# EAGLE design vga_wifi (EAGLE 7.3.0)
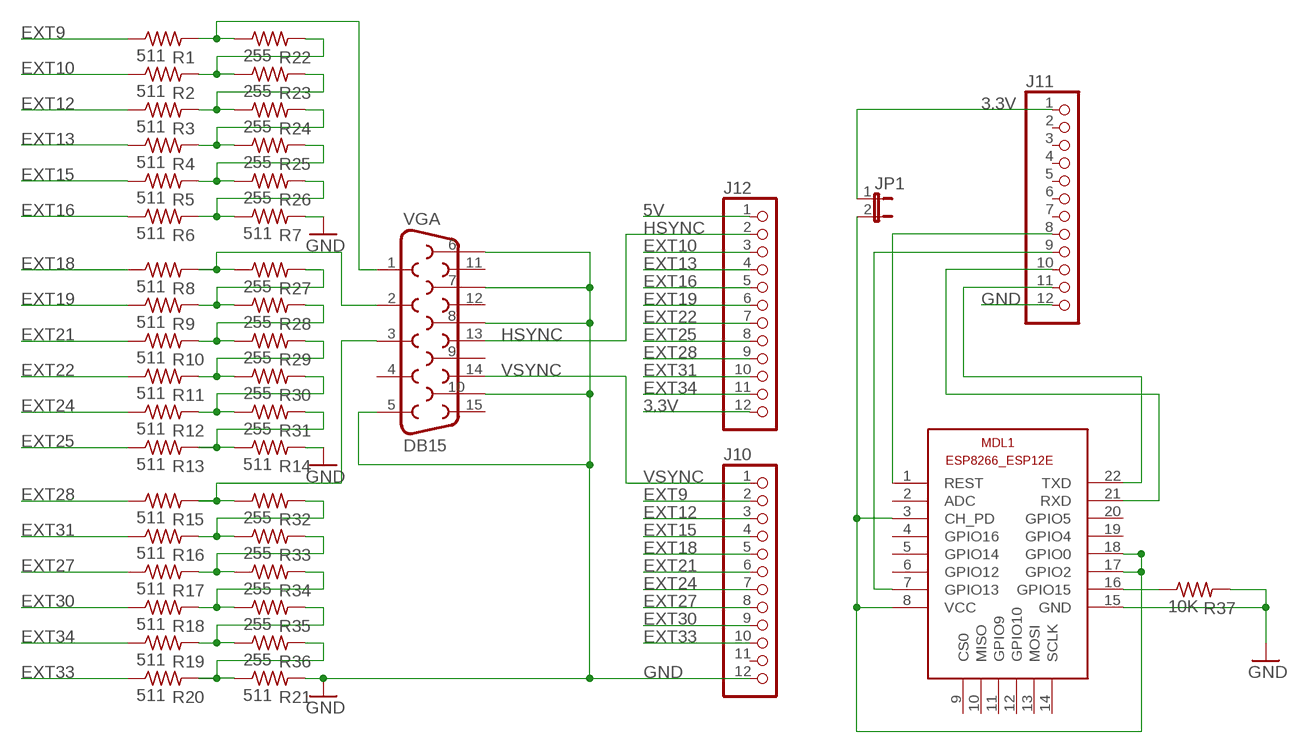
[diagram p0: schematic, sheet 1]

## Parts
J10  PINHD-1X12  [1X12]
J11  PINHD-1X12  [1X12]
J12  PINHD-1X12  [1X12]
JP1  JP1E  [JP1]
MDL1  ESP8266-12EESP8266-ESP12E  [ESP8266-ESP12E]
R1  511  R-US_R0805  [R0805]
R2  511  R-US_R0805  [R0805]
R3  511  R-US_R0805  [R0805]
R4  511  R-US_R0805  [R0805]
R5  511  R-US_R0805  [R0805]
R6  511  R-US_R0805  [R0805]
R7  511  R-US_R0805  [R0805]
R8  511  R-US_R0805  [R0805]
R9  511  R-US_R0805  [R0805]
R10  511  R-US_R0805  [R0805]
R11  511  R-US_R0805  [R0805]
R12  511  R-US_R0805  [R0805]
R13  511  R-US_R0805  [R0805]
R14  511  R-US_R0805  [R0805]
R15  511  R-US_R0805  [R0805]
R16  511  R-US_R0805  [R0805]
R17  511  R-US_R0805  [R0805]
R18  511  R-US_R0805  [R0805]
R19  511  R-US_R0805  [R0805]
R20  511  R-US_R0805  [R0805]
R21  511  R-US_R0805  [R0805]
R22  255  R-US_R0805  [R0805]
R23  255  R-US_R0805  [R0805]
R24  255  R-US_R0805  [R0805]
R25  255  R-US_R0805  [R0805]
R26  255  R-US_R0805  [R0805]
R27  255  R-US_R0805  [R0805]
R28  255  R-US_R0805  [R0805]
R29  255  R-US_R0805  [R0805]
R30  255  R-US_R0805  [R0805]
R31  255  R-US_R0805  [R0805]
R32  255  R-US_R0805  [R0805]
R33  255  R-US_R0805  [R0805]
R34  255  R-US_R0805  [R0805]
R35  255  R-US_R0805  [R0805]
R36  255  R-US_R0805  [R0805]
R37  10K  R-US_R0805  [R0805]
VGA  DB15  [DB15]

## Nets
3.3V: J11.1 J12.12 JP1.1
5V: J12.1
EXT9: J10.2 R1.1
EXT10: J12.3 R2.1
EXT12: J10.3 R3.1
EXT13: J12.4 R4.1
EXT15: J10.4 R5.1
EXT16: J12.5 R6.1
EXT18: J10.5 R8.1
EXT19: J12.6 R9.1
EXT21: J10.6 R10.1
EXT22: J12.7 R11.1
EXT24: J10.7 R12.1
EXT25: J12.8 R13.1
EXT27: J10.8 R17.1
EXT28: J12.9 R15.1
EXT30: J10.9 R18.1
EXT31: J12.10 R16.1
EXT33: J10.10 R20.1
EXT34: J12.11 R19.1
GND: J10.12 J11.12 MDL1.15(GND) R7.2 R14.2 R21.2 R37.2 VGA.5 VGA.6 VGA.7 VGA.8 VGA.10
GREEN: R8.2 R27.1 VGA.2
HSYNC: J12.2 VGA.13
N$1: MDL1.16(GPIO15) R37.1
N$2: J11.9 MDL1.7(GPIO13)
N$3: J11.10 MDL1.21(RXD)
N$4: J11.11 MDL1.22(TXD)
N$5: J11.8 MDL1.1(REST)
N$6: R20.2 R21.1 R36.2
N$8: R9.2 R27.2 R28.1
N$15: R2.2 R22.2 R23.1
N$16: R1.2 R22.1 VGA.1
N$17: R12.2 R30.2 R31.1
N$18: R6.2 R7.1 R26.2
N$19: R3.2 R23.2 R24.1
N$21: R4.2 R24.2 R25.1
N$23: R5.2 R25.2 R26.1
N$25: R11.2 R29.2 R30.1
N$26: R13.2 R14.1 R31.2
N$27: R10.2 R28.2 R29.1
N$41: R15.2 R32.1 VGA.3
N$42: R16.2 R32.2 R33.1
N$43: R17.2 R33.2 R34.1
N$44: R18.2 R34.2 R35.1
N$45: R19.2 R35.2 R36.1
VIN: JP1.2 MDL1.3(CH_PD) MDL1.8(VCC) MDL1.17(GPIO2) MDL1.18(GPIO0)
VSYNC: J10.1 VGA.14
Unconnected: J10.11 J11.2 J11.3 J11.4 J11.5 J11.6 J11.7 MDL1.2(ADC) MDL1.4(GPIO16) MDL1.5(GPIO14) MDL1.6(GPIO12) MDL1.9(CS0) MDL1.10(MISO) MDL1.11(GPIO9) MDL1.12(GPIO10) MDL1.13(MOSI) MDL1.14(SCLK) MDL1.19(GPIO4) MDL1.20(GPIO5) VGA.4 VGA.9 VGA.11 VGA.12 VGA.15

## Library data of the parts
J10-J12 = pinhead:PINHD-1X12: PIN HEADER
JP1 = jumper:JP1E: JUMPER
MDL1 = ESP8266-ESP12E:ESP8266-12E: ESP8266-12E with additional I/O and GPIO04/05 corrected The author cannot warrant that this library is free from error or will meet your specific requirements. Created by PuceBaboon.com. Komagane, Nagano, JAPAN
R1-R37 = rcl:R-US_: RESISTOR, American symbol
VGA = SparkFun-Connectors:DB15: DB15 / VGA right angle through-hole female connector.

## Board
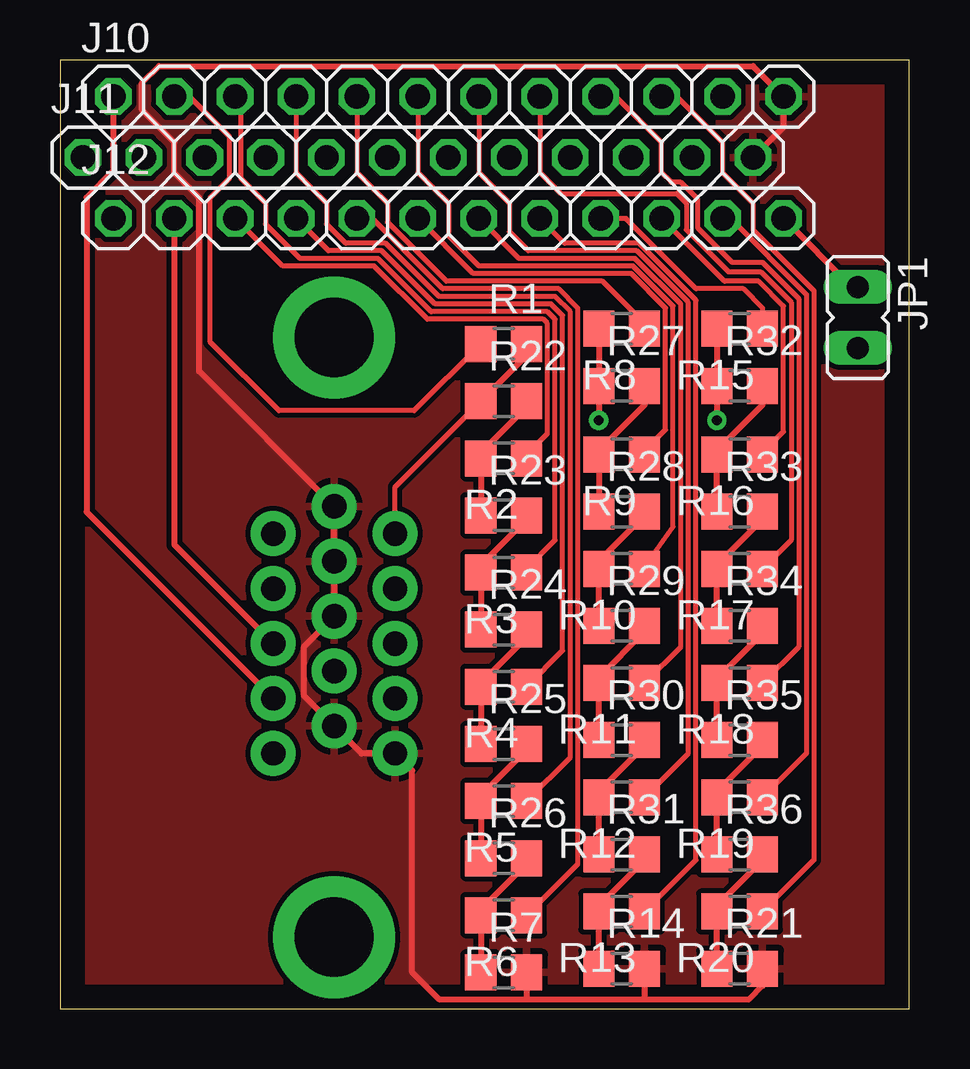
[diagram p1: board, top side]
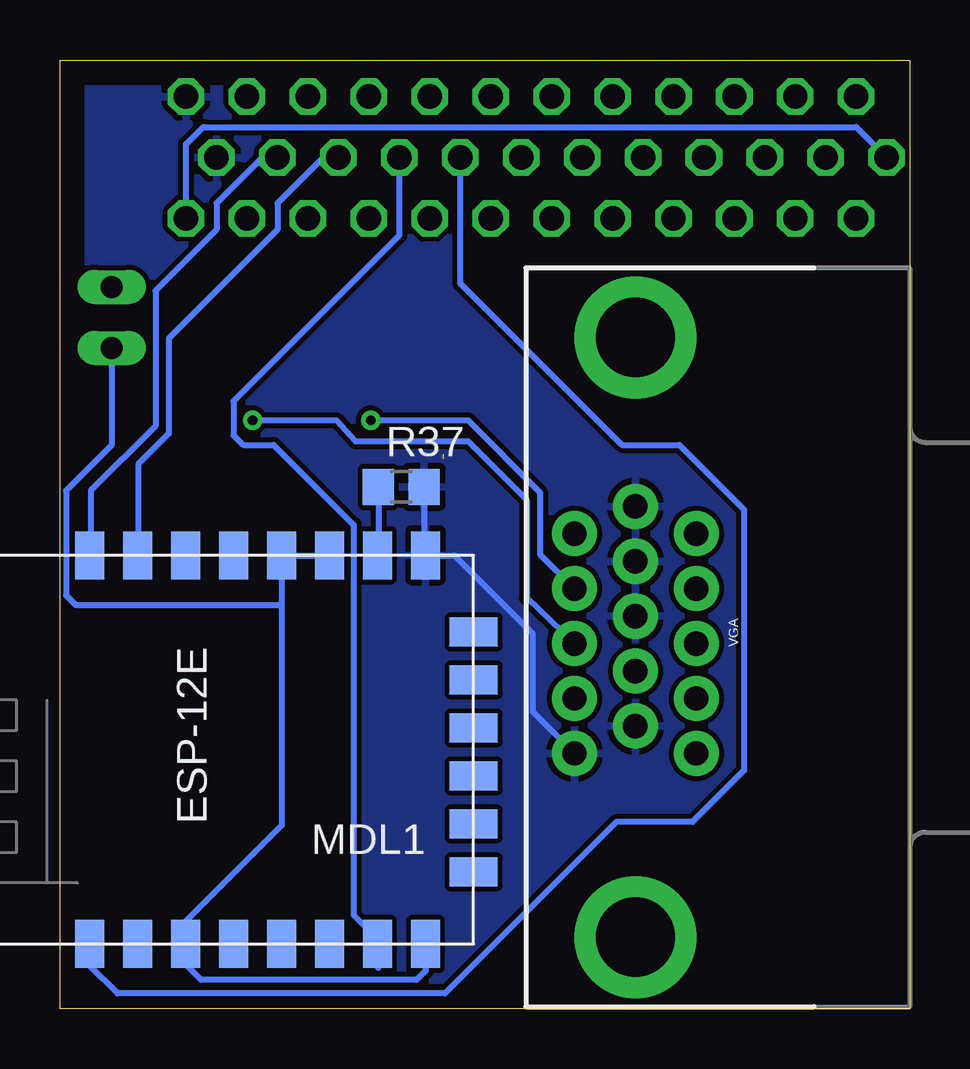
[diagram p2: board, bottom side, seen from below]

Size 35.4 x 39.53 mm. Coordinates in mm from the lower left corner, seen from the top.
Outline: 0,39.52 0,0 35.4,0 35.4,39.53 0,39.53
Copper layers (1*16): Top 0.035mm / dielectric 1.5mm / Bottom 0.035mm
Design rules "default": minimum track width 10mil, minimum drill 24mil, track to track 8mil, track to pad 8mil, pad to pad 8mil, via to via 8mil, smd to smd 8mil, copper to edge 40mil, drill to drill 8mil, minimum pad ring 10mil, minimum via ring 8mil, stop-mask expansion 4mil, vias tented up to drill 0mil, thermal gap 10mil

### Footprints (pad centres in the part's own frame; a part is rotated, then mirrored left to right if it is on the bottom)
1X12 = drill 1.016 octagon: 1 -13.97,0; 2 -11.43,0; 3 -8.89,0; 4 -6.35,0; 5 -3.81,0; 6 -1.27,0; 7 1.27,0; 8 3.81,0; 9 6.35,0; 10 8.89,0; 11 11.43,0; 12 13.97,0
JP1 = drill 0.914 long: 1 0,-1.27; 2 0,1.27
ESP8266-ESP12E = smd 2 x 1.2: 1 0,16; 2 0,14; 3 0,12; 4 0,10; 5 0,8; 6 0,6; 7 0,4; 8 0,2; 15 16.2,2; 16 16.2,4; 17 16.2,6; 18 16.2,8; 19 16.2,10; 20 16.2,12; 21 16.2,14; 22 16.2,16 | smd 1.2 x 2: 9 3,0; 10 5,0; 11 7,0; 12 9,0; 13 11,0; 14 13,0
R0805 = smd 1.3 x 1.5: 1 -0.95,0; 2 0.95,0
DB15 = drill 1.016 pad 1.88: 1 -4.32,-7.62; 2 -2.03,-7.62; 3 0.26,-7.62; 4 2.55,-7.62; 5 4.84,-7.62; 6 -5.46,-5.08; 7 -3.17,-5.08; 8 -0.88,-5.08; 9 1.41,-5.08; 10 3.7,-5.08; 11 -4.32,-2.54; 12 -2.03,-2.54; 13 0.26,-2.54; 14 2.55,-2.54; 15 4.84,-2.54 | drill 3.302 pad 5.08: G1 -12.5,-5.08; G2 12.5,-5.08

### Placement (x,y rotation side)
J10  16.19,38.02 0 top
J11  14.92,35.48 0 top
J12  16.19,32.94 0 top
JP1  33.26,28.81 180 top
MDL1  18.18,2.7 90 bottom
R1  18.49,27.7 0 top
R2  18.49,22.94 180 top
R3  18.49,18.18 180 top
R4  18.49,13.41 180 top
R5  18.49,8.65 180 top
R6  18.49,3.89 180 top
R7  18.49,1.51 0 top
R8  23.42,28.34 180 top
R9  23.42,23.1 180 top
R10  23.42,18.34 180 top
R11  23.42,13.57 180 top
R12  23.42,8.81 180 top
R13  23.42,4.05 180 top
R14  23.42,1.67 0 top
R15  28.34,28.34 180 top
R16  28.34,23.1 180 top
R17  28.34,18.34 180 top
R18  28.34,13.57 180 top
R19  28.34,8.81 180 top
R20  28.34,4.05 180 top
R21  28.34,1.67 0 top
R22  18.49,25.32 0 top
R23  18.49,20.56 0 top
R24  18.49,15.8 0 top
R25  18.49,11.03 0 top
R26  18.49,6.27 0 top
R27  23.42,25.96 0 top
R28  23.42,20.72 0 top
R29  23.42,15.95 0 top
R30  23.42,11.19 0 top
R31  23.42,6.43 0 top
R32  28.34,25.96 0 top
R33  28.34,20.72 0 top
R34  28.34,15.95 0 top
R35  28.34,11.19 0 top
R36  28.34,6.43 0 top
R37  21.19,21.75 0 bottom
VGA  6.35,15.48 270 bottom

### Tracks (layer width: path | path; a pad name or v marks a point on that pad's centre or on a via)
3.3V
  Top 0.254: JP1.1 33.02,30.08 J12.12
  Bottom 0.254: J12.12 30.16,36.04 29.45,36.75 2.22,36.75 J11.1
EXT9
  Top 0.203: R1.1 14.77,24.92 9.13,24.92 6.27,27.78 6.27,33.81 7.06,34.61 7.06,36.35 5.4,38.02 J10.2
EXT10  (1 unrouted)
  Top 0.203: 19.44,23.1 20.32,23.97 20.32,28.57 20.16,28.73 15.32,28.73 13.1,30.96 9.29,30.96 J12.3
EXT12
  Top 0.203: R3.1 19.44,18.33 20.64,19.53 20.64,28.73 20.32,29.05 15.48,29.05 13.26,31.27 10,31.27 8.57,32.7 8.57,33.58 7.54,34.61 7.54,37.78 J10.3
EXT13
  Top 0.203: 19.44,13.49 R4.1 20.95,14.93 20.95,28.89 20.48,29.37 15.64,29.37 13.41,31.59 11.19,31.59 J12.4
EXT15
  Top 0.203: 19.44,8.73 R5.1 21.27,10.48 21.27,29.05 20.64,29.69 15.8,29.69 13.57,31.91 11.91,31.91 11.11,32.7 11.11,33.58 9.84,34.85 J10.4
EXT16
  Top 0.203: 19.53,3.89 R6.1 21.59,6.04 21.59,29.21 20.8,30 15.95,30 13.02,32.94 J12.5
EXT18
  Top 0.203: R8.1 24.37,28.58 22.62,30.32 16.11,30.32 13.65,32.78 13.65,33.58 12.38,34.85 J10.5
EXT19
  Top 0.203: R9.1 24.37,23.25 25.24,24.13 25.24,29.21 23.81,30.64 17.22,30.64 J12.6
EXT21
  Top 0.203: R10.1 24.37,18.41 25.56,20.08 25.56,29.29 23.89,30.96 17.46,30.96 16.19,32.23 16.19,33.58 14.92,34.85 J10.6
EXT22
  Top 0.203: 24.37,13.65 R11.1 25.88,15.08 25.88,29.37 23.97,31.27 19.13,31.27 J12.7
EXT24
  Top 0.203: 24.37,9.05 R12.1 26.19,10.64 26.19,29.45 24.05,31.59 19.53,31.59 18.73,32.38 18.73,33.58 17.46,34.85 J10.7
EXT25
  Top 0.203: 24.37,4.2 R13.1 26.51,6.19 26.51,29.53 24.13,31.91 21.03,31.91 J12.8
EXT27
  Top 0.203: J10.8 20,34.85 20.88,33.97 25.72,33.97 26.11,33.58 26.11,32.46 27.86,30.72 29.21,30.72 30.48,29.45 30.48,19.53 R17.1
EXT28
  Top 0.203: J12.9 23.57,32.94 26.51,30 28.5,30 29.29,29.21 R15.1
EXT30
  Top 0.203: J10.9 23.18,38.02 25.08,36.12 25.08,34.85 25.48,34.45 25.88,34.45 26.59,33.73 26.59,32.54 28.02,31.11 29.29,31.11 30.8,29.61 30.8,15.08 R18.1
EXT31
  Top 0.203: R16.1 29.29,23.18 30.16,24.05 30.16,29.29 29.13,30.32 27.7,30.32 J12.10
EXT33
  Top 0.203: J10.10 25.72,38.02 27.62,36.12 27.62,34.85 28.89,33.58 28.89,32.46 31.43,29.92 31.43,6.19 R20.1
EXT34
  Top 0.203: J12.11 27.94,32.94 31.11,29.77 31.11,10.64 R19.1
GND
  Top 0.254: R7.2 19.45,0.4 | R21.2 29.29,0.95 28.73,0.4 24.45,0.4 | 19.45,0.4 15.8,0.4 14.68,1.51 14.68,9.92 VGA.5 12.57,10.64 VGA.10 10.16,13.05 10.16,15.08 11.36,16.28 VGA.8 VGA.7 VGA.6 5.79,26.57 5.79,33.81 4.76,34.85 4.76,36.12 3.41,37.47 3.41,38.58 4.13,39.29 28.89,39.29 J10.12 30.16,36.75 J11.12 | 19.45,0.4 24.45,0.4 | R14.2 24.37,0.48 24.45,0.4
  Bottom 0.254: VGA.5 15.72,12.38 15.72,15.64 18.98,18.9 MDL1.15 20.24,18.96 R37.2
  pour Bottom: 0.32,39.21 35.16,39.21 35.16,0.32 0.32,0.32
  pour Top: 0.32,39.21 35.16,39.21 35.16,0.32 0.32,0.32
GREEN  (via drill 0.4)
  Top 0.254: R8.2 R27.1 v22.47,24.53
  Bottom 0.254: v22.47,24.53 v22.46,24.53 18.41,24.53 15.4,21.51 15.4,18.94 VGA.2
HSYNC
  Top 0.254: J12.2 4.76,19.35 VGA.13
N$1
  Bottom 0.254: R37.1 22.14,18.93 MDL1.16
N$2
  Bottom 0.254: J11.9 21.27,32.23 28.18,25.32 28.18,23.89 27.78,23.5 26.51,23.5 23.18,20.16 23.18,3.89 22.15,2.86 22.15,1.7 MDL1.7
N$3
  Bottom 0.254: J11.10 24.45,35.48 26.35,33.58 26.35,32.46 30.88,27.94 30.88,23.97 32.15,22.7 32.15,18.93 MDL1.21
N$4
  Bottom 0.254: J11.11 26.99,35.48 28.89,33.58 28.89,32.46 31.43,29.92 31.43,24.29 34.13,21.59 34.13,18.94 MDL1.22
N$5
  Bottom 0.254: J11.8 18.73,30.24 11.99,23.5 9.6,23.5 6.91,20.8 6.91,9.92 9.05,7.78 12.22,7.78 19.37,0.64 33.02,0.64 34.21,1.83 34.21,2.67 MDL1.1
N$6
  Top 0.254: R36.2 29.29,6.19 27.39,4.29 R20.2 R21.1
N$8
  Top 0.254: 24.37,25.71 R27.2 24.37,25.16 22.47,23.26 R9.2 R28.1
N$15
  Top 0.254: R22.2 19.44,25.08 17.54,23.18 R2.2 R23.1
N$16
  Top 0.203: VGA.1 13.97,21.75 R22.1
  Top 0.254: R1.2 19.44,27.22 R22.1
N$17
  Top 0.254: R30.2 24.37,10.95 22.47,9.05 R12.2 R31.1
N$18
  Top 0.254: R26.2 19.44,6.03 17.54,4.13 R6.2 R7.1
N$19
  Top 0.254: R23.2 19.44,20.4 17.54,18.5 R3.2 R24.1
N$21
  Top 0.254: R24.2 19.44,15.48 17.54,13.58 R4.2 R25.1
N$23
  Top 0.254: R25.2 19.44,10.79 17.54,8.89 R5.2 R26.1
N$25
  Top 0.254: R29.2 24.37,15.71 22.47,13.81 R11.2 R30.1
N$26
  Top 0.254: R31.2 24.37,6.19 22.47,4.29 R13.2 R14.1
N$27
  Top 0.254: R28.2 24.37,20.56 22.47,18.66 R10.2 R29.1
N$41  (via drill 0.4)
  Top 0.254: R15.2 R32.1 v27.39,24.53
  Bottom 0.254: v27.39,24.53 v27.38,24.53 23.89,24.53 23.1,23.65 18.41,23.65 15.95,21.19 15.95,17.12 VGA.3
N$42
  Top 0.254: R33.1 R16.2 27.39,23.26 29.29,25.16 R32.2
N$43
  Top 0.254: R33.2 29.29,20.4 27.39,18.5 R17.2 R34.1
N$44
  Top 0.254: R34.2 29.29,15.63 27.39,13.73 R18.2 R35.1
N$45
  Top 0.254: R35.2 29.29,10.95 27.39,9.05 R19.2 R36.1
VIN
  Bottom 0.254: MDL1.17 MDL1.18 26.18,16.91 | JP1.2 33.26,23.5 35.16,21.59 35.16,17.22 34.77,16.83 26.26,16.83 26.18,16.91 | 26.18,16.91 26.18,7.64 30.16,3.65 30.16,2.71 MDL1.3 30.16,2.68 30.16,1.83 29.53,1.19 20.56,1.19 20.18,1.57 MDL1.8
VSYNC
  Top 0.254: J10.1 2.22,34.92 1.11,33.81 1.11,20.71 VGA.14